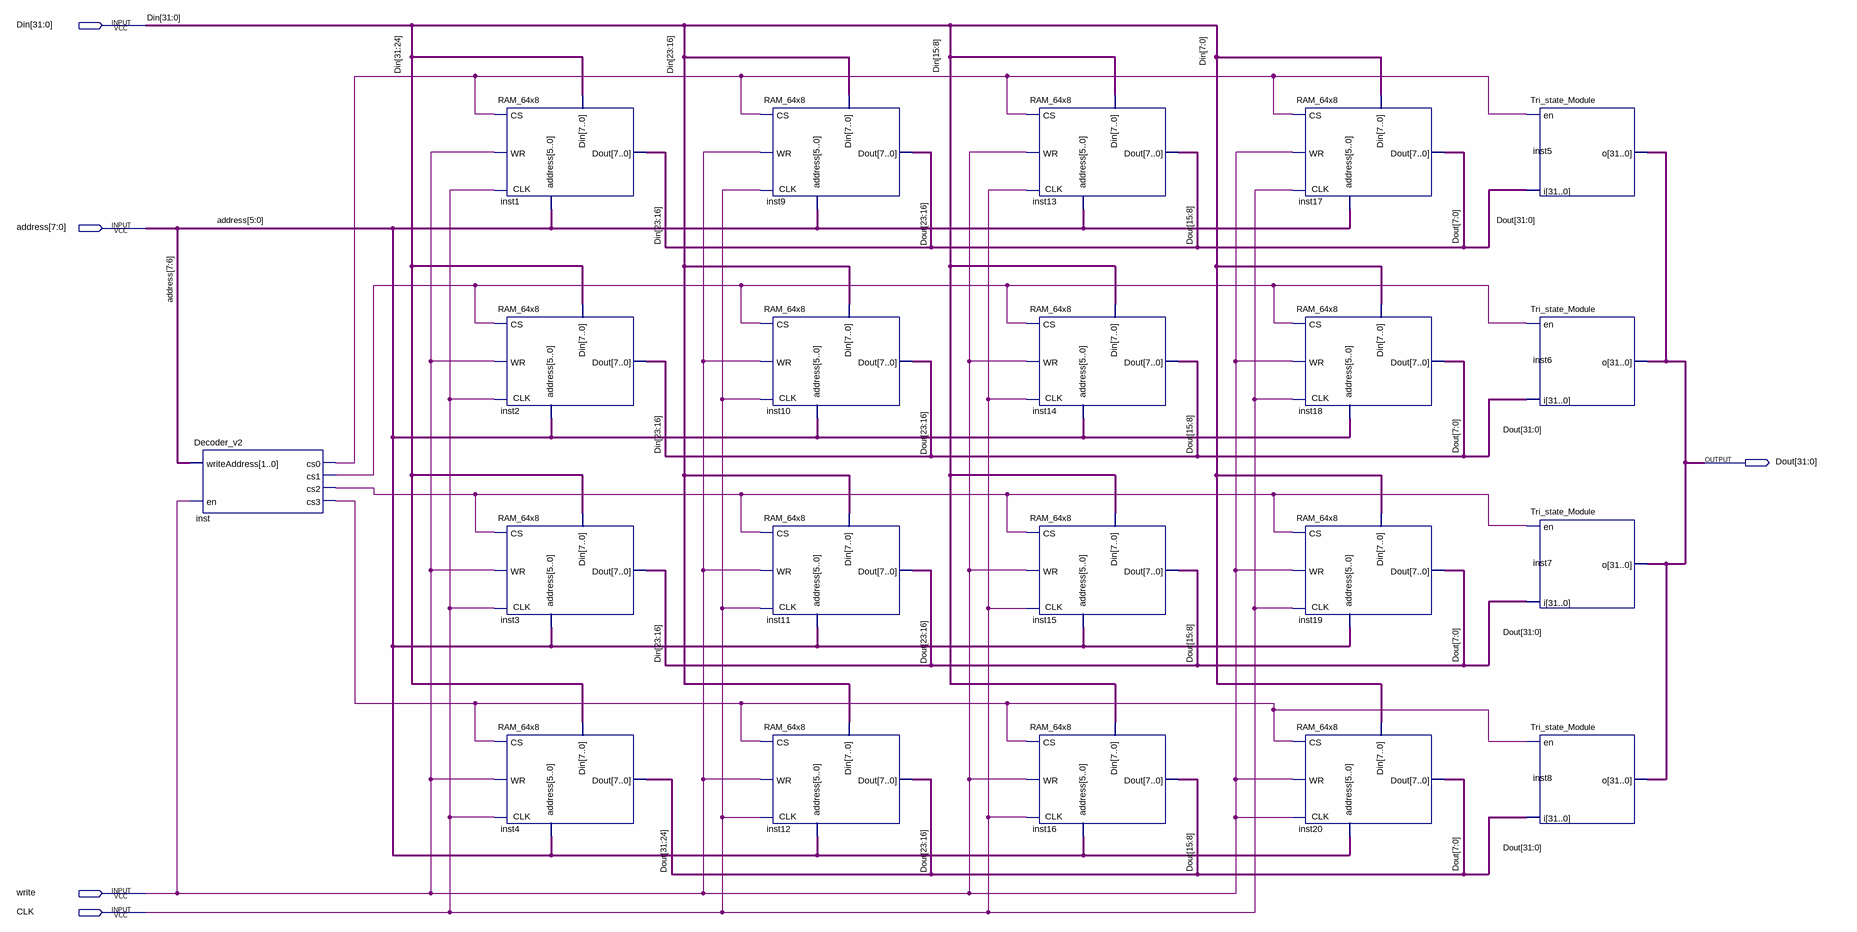
[diagram p0: schematic sheet]
// Quartus schematic RAM_256x32_inside.bdf as structural Verilog: 21 symbols, 5 pins
module RAM_256x32_inside (
  input  [31:0] Din,
  input  [7:0] address,
  input  write,
  input  CLK,
  output [31:0] Dout
);

  wire inst_cs0, inst_cs1, inst_cs2, inst_cs3;

  Decoder_v2 inst (
    .writeAddress(address[7:6]), .en(write), .cs0(inst_cs0), .cs1(inst_cs1), .cs2(inst_cs2), .cs3(inst_cs3));
  RAM_64x8 inst1 (.CS(inst_cs0), .WR(write), .CLK(CLK), .address(address[5:0]), .Din(Din), .Dout(Din[23:16]));
  RAM_64x8 inst2 (.CS(inst_cs1), .WR(write), .CLK(CLK), .address(address[5:0]), .Din(Din[31:24]), .Dout(Din[23:16]));
  RAM_64x8 inst3 (.CS(inst_cs2), .WR(write), .CLK(CLK), .address(address[5:0]), .Din(Din[31:24]), .Dout(Din[23:16]));
  RAM_64x8 inst4 (.CS(inst_cs3), .WR(write), .CLK(CLK), .address(address[5:0]), .Din(Din[31:24]), .Dout(Dout[31:24]));
  RAM_64x8 inst9 (.CS(inst_cs0), .WR(write), .CLK(CLK), .address(address[5:0]), .Din(Din), .Dout(Dout[23:16]));
  RAM_64x8 inst10 (.CS(inst_cs1), .WR(write), .CLK(CLK), .address(address[5:0]), .Din(Din[23:16]), .Dout(Dout[23:16]));
  RAM_64x8 inst11 (.CS(inst_cs2), .WR(write), .CLK(CLK), .address(address[5:0]), .Din(Din[23:16]), .Dout(Dout[23:16]));
  RAM_64x8 inst12 (.CS(inst_cs3), .WR(write), .CLK(CLK), .address(address[5:0]), .Din(Din[23:16]), .Dout(Dout[23:16]));
  RAM_64x8 inst13 (.CS(inst_cs0), .WR(write), .CLK(CLK), .address(address[5:0]), .Din(Din), .Dout(Dout[15:8]));
  RAM_64x8 inst14 (.CS(inst_cs1), .WR(write), .CLK(CLK), .address(address[5:0]), .Din(Din[15:8]), .Dout(Dout[15:8]));
  RAM_64x8 inst15 (.CS(inst_cs2), .WR(write), .CLK(CLK), .address(address[5:0]), .Din(Din[15:8]), .Dout(Dout[15:8]));
  RAM_64x8 inst16 (.CS(inst_cs3), .WR(write), .CLK(CLK), .address(address[5:0]), .Din(Din[15:8]), .Dout(Dout[15:8]));
  RAM_64x8 inst17 (.CS(inst_cs0), .WR(write), .CLK(CLK), .address(address[5:0]), .Din(Din), .Dout(Dout[7:0]));
  RAM_64x8 inst18 (.CS(inst_cs1), .WR(write), .CLK(CLK), .address(address[5:0]), .Din(Din[7:0]), .Dout(Dout[7:0]));
  RAM_64x8 inst19 (.CS(inst_cs2), .WR(write), .CLK(CLK), .address(address[5:0]), .Din(Din[7:0]), .Dout(Dout[7:0]));
  RAM_64x8 inst20 (.CS(inst_cs3), .WR(write), .CLK(write), .address(address[5:0]), .Din(Din[7:0]), .Dout(Dout[7:0]));
  Tri_state_Module inst5 (.i(Dout), .en(inst_cs0), .o(Dout));
  Tri_state_Module inst6 (.i(Dout), .en(inst_cs1), .o(Dout));
  Tri_state_Module inst7 (.i(Dout), .en(inst_cs2), .o(Dout));
  Tri_state_Module inst8 (.i(Dout), .en(inst_cs3), .o(Dout));
endmodule
